# EasyEDA schematic SCH_PCB_Dashboy_subboard_2023-03-29.json
TITLE: Sheet_1; REV: 1.0; Date: 2023-03-20; Sheet: 1/1; Company: Your Company
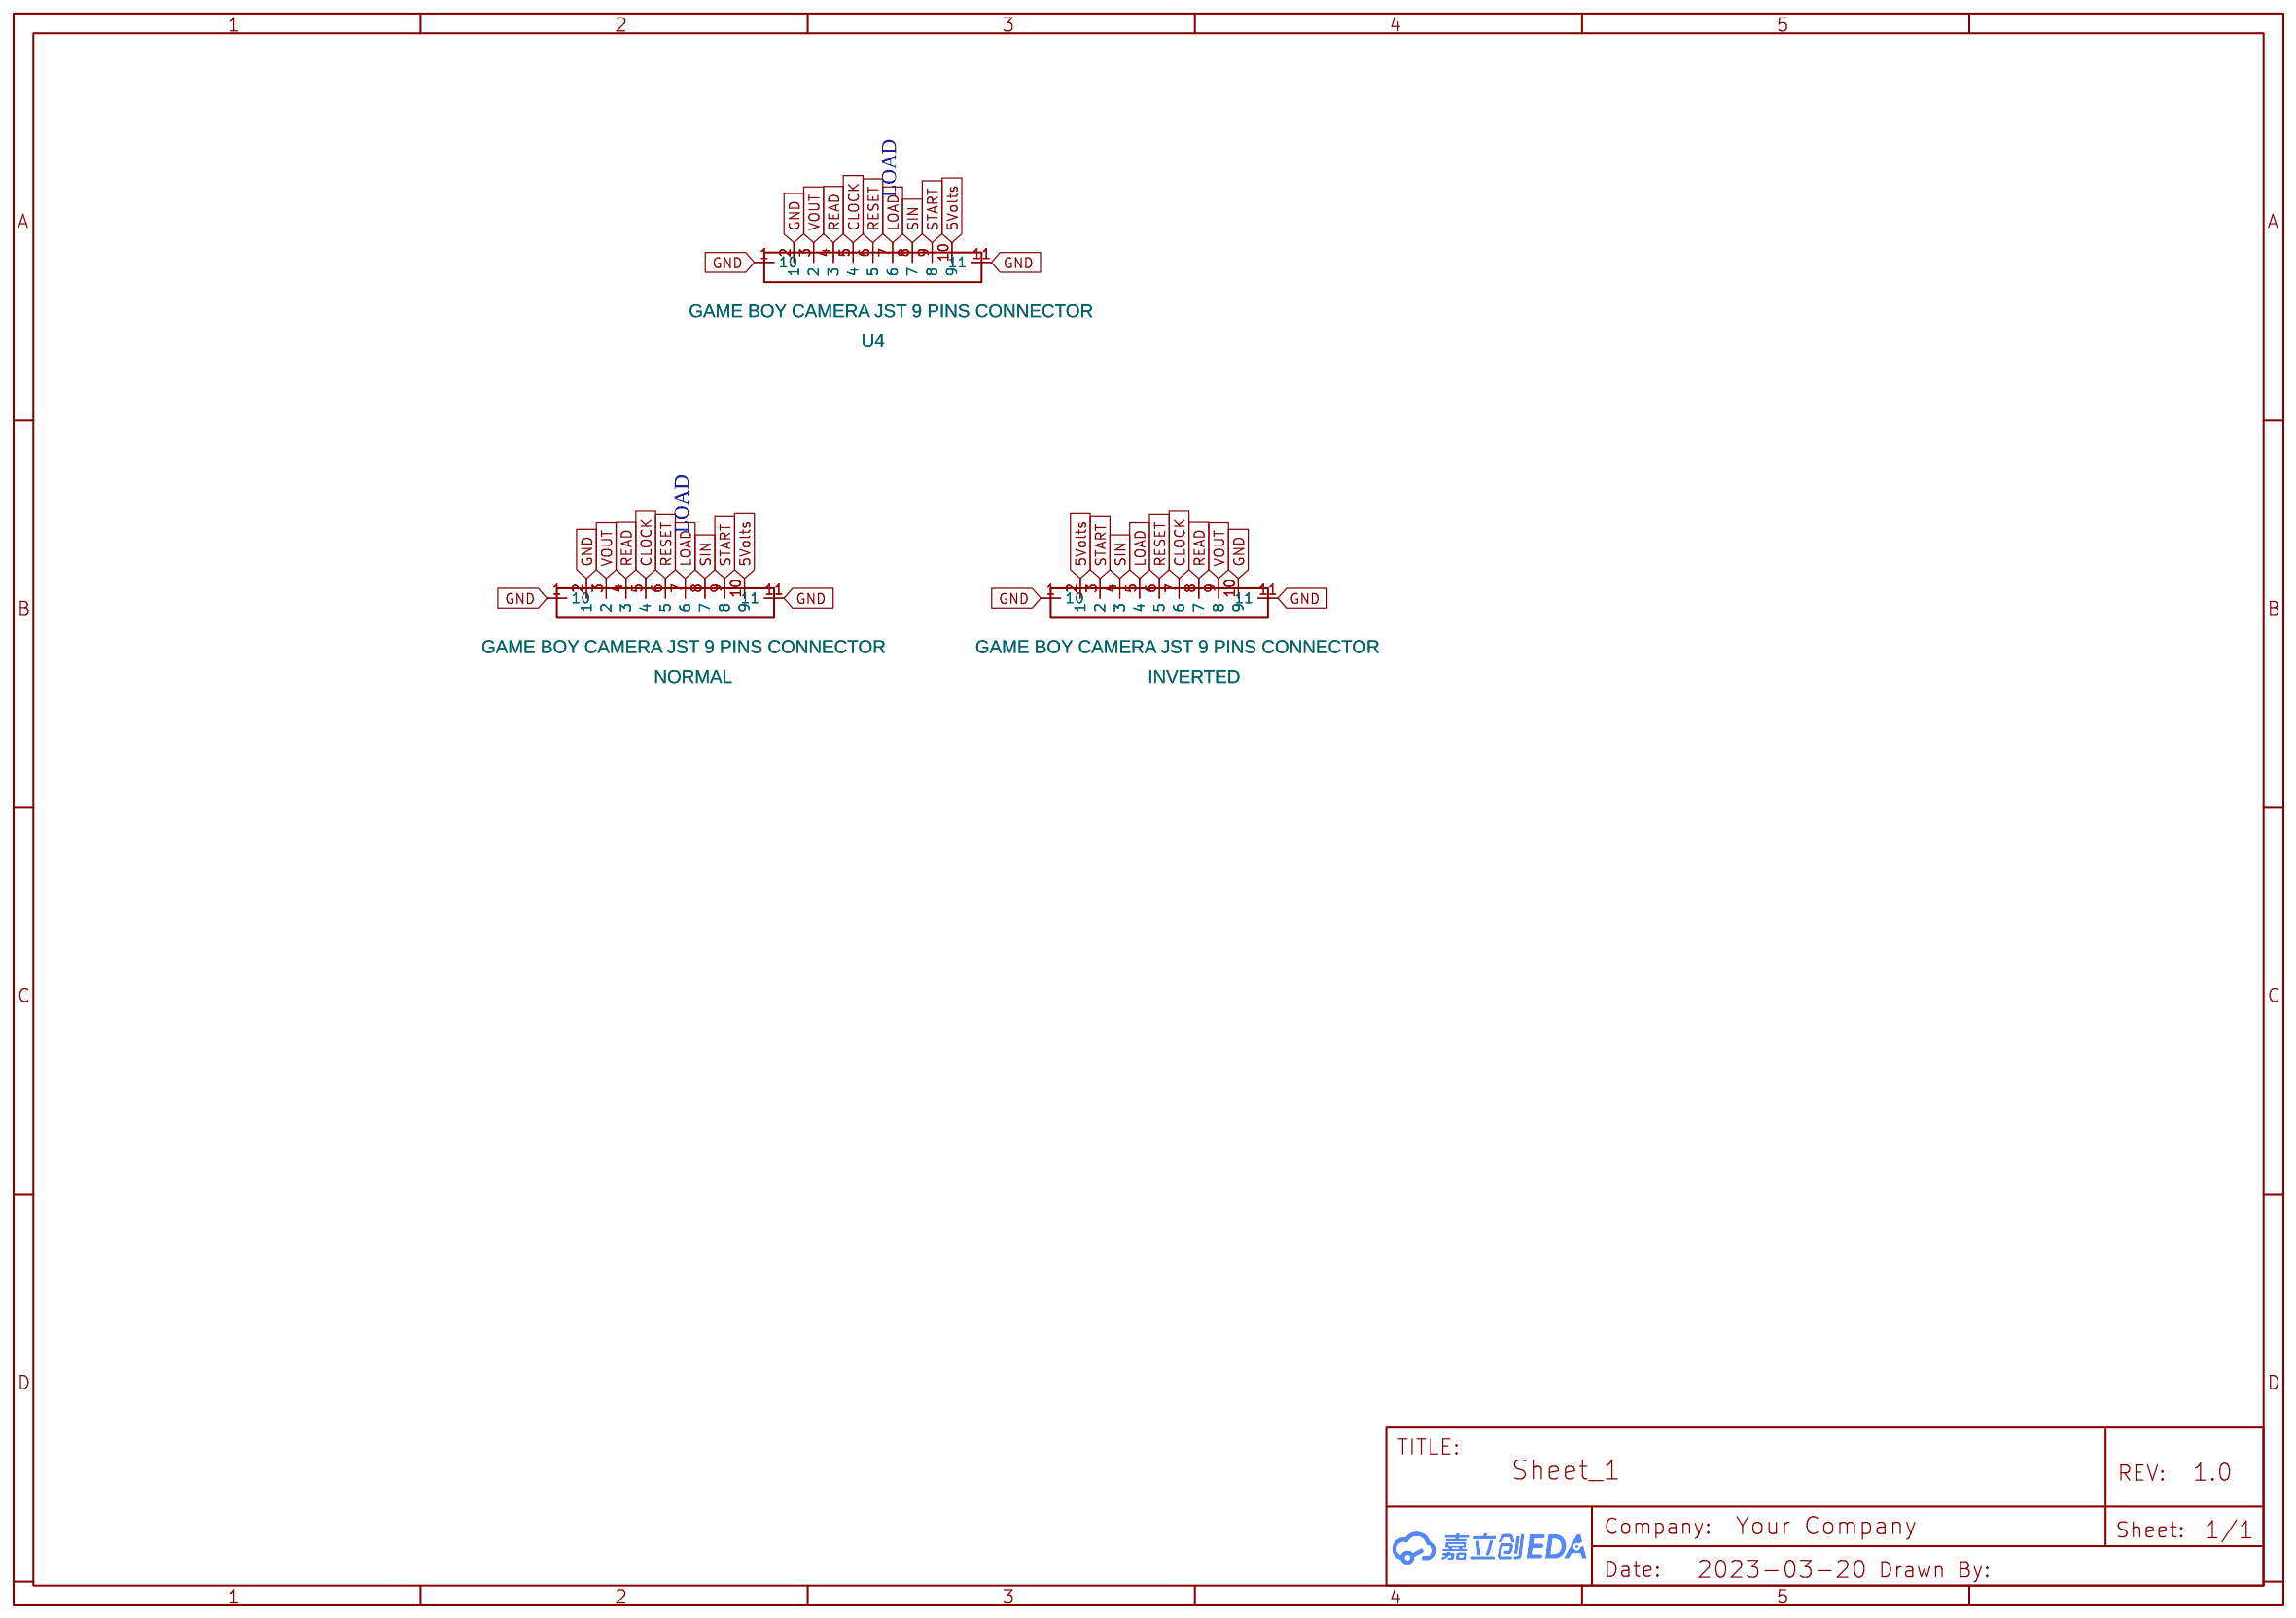
[diagram p0: schematic sheet]

## Parts
INVERTED  GAME BOY CAMERA JST 9 PINS CONNECTOR  [GAME BOY CAMERA JST 9 PINS CONNECTOR]
NORMAL  GAME BOY CAMERA JST 9 PINS CONNECTOR  [GAME BOY CAMERA JST 9 PINS CONNECTOR]
U4  GAME BOY CAMERA JST 9 PINS CONNECTOR  [GAME BOY CAMERA JST 9 PINS CONNECTOR]

## Library data of the parts
INVERTED NORMAL U4 = GAME BOY CAMERA JST 9 PINS CONNECTOR: Contributor: raphael.boichot

## Nets
5Volts: INVERTED.2(1) NORMAL.10(9) U4.10(9)
GND: INVERTED.1(10) INVERTED.10(9) INVERTED.11 NORMAL.1(10) NORMAL.2(1) NORMAL.11 U4.1(10) U4.2(1) U4.11
CLOCK: INVERTED.7(6) NORMAL.5(4) U4.5(4)
LOAD: INVERTED.5(4) NORMAL.7(6) U4.7(6)
READ: INVERTED.8(7) NORMAL.4(3) U4.4(3)
RESET: INVERTED.6(5) NORMAL.6(5) U4.6(5)
SIN: INVERTED.4(3) NORMAL.8(7) U4.8(7)
START: INVERTED.3(2) NORMAL.9(8) U4.9(8)
VOUT: INVERTED.9(8) NORMAL.3(2) U4.3(2)

## Notes on the sheet
- LOAD
- LOAD
